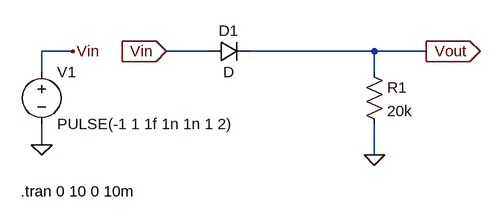
[diagram p0: schematic Diode resistor series.asc]
Diode resistor series.asc, the LTspice schematic file:
Version 4
SHEET 1 880 680
WIRE 64 64 16 64
WIRE 272 64 208 64
WIRE 528 64 336 64
WIRE 608 64 528 64
WIRE 16 96 16 64
WIRE 528 96 528 64
WIRE 16 208 16 176
WIRE 528 224 528 176
FLAG 528 224 0
FLAG 608 64 Vout
IOPIN 608 64 Out
FLAG 208 64 Vin
IOPIN 208 64 In
FLAG 16 208 0
FLAG 64 64 Vin
SYMBOL diode 272 80 R270
WINDOW 0 32 32 VTop 2
WINDOW 3 0 32 VBottom 2
SYMATTR InstName D1
SYMBOL voltage 16 80 R0
WINDOW 123 0 0 Left 0
WINDOW 39 0 0 Left 0
SYMATTR InstName V1
SYMATTR Value PULSE(-1 1 1f 1n 1n 1 2)
SYMBOL res 512 80 R0
SYMATTR InstName R1
SYMATTR Value 20k
TEXT -16 280 Left 2 !.tran 0 10 0 10m

The netlist it stands for:
* Diode resistor series.asc
D1 Vin Vout D
V1 Vin 0 PULSE(-1 1 1f 1n 1n 1 2)
R1 Vout 0 20k
.model D D
.lib standard.dio
.tran 0 10 0 10m
.backanno
.end